# EAGLE design Nyan (EAGLE 6.6.0)
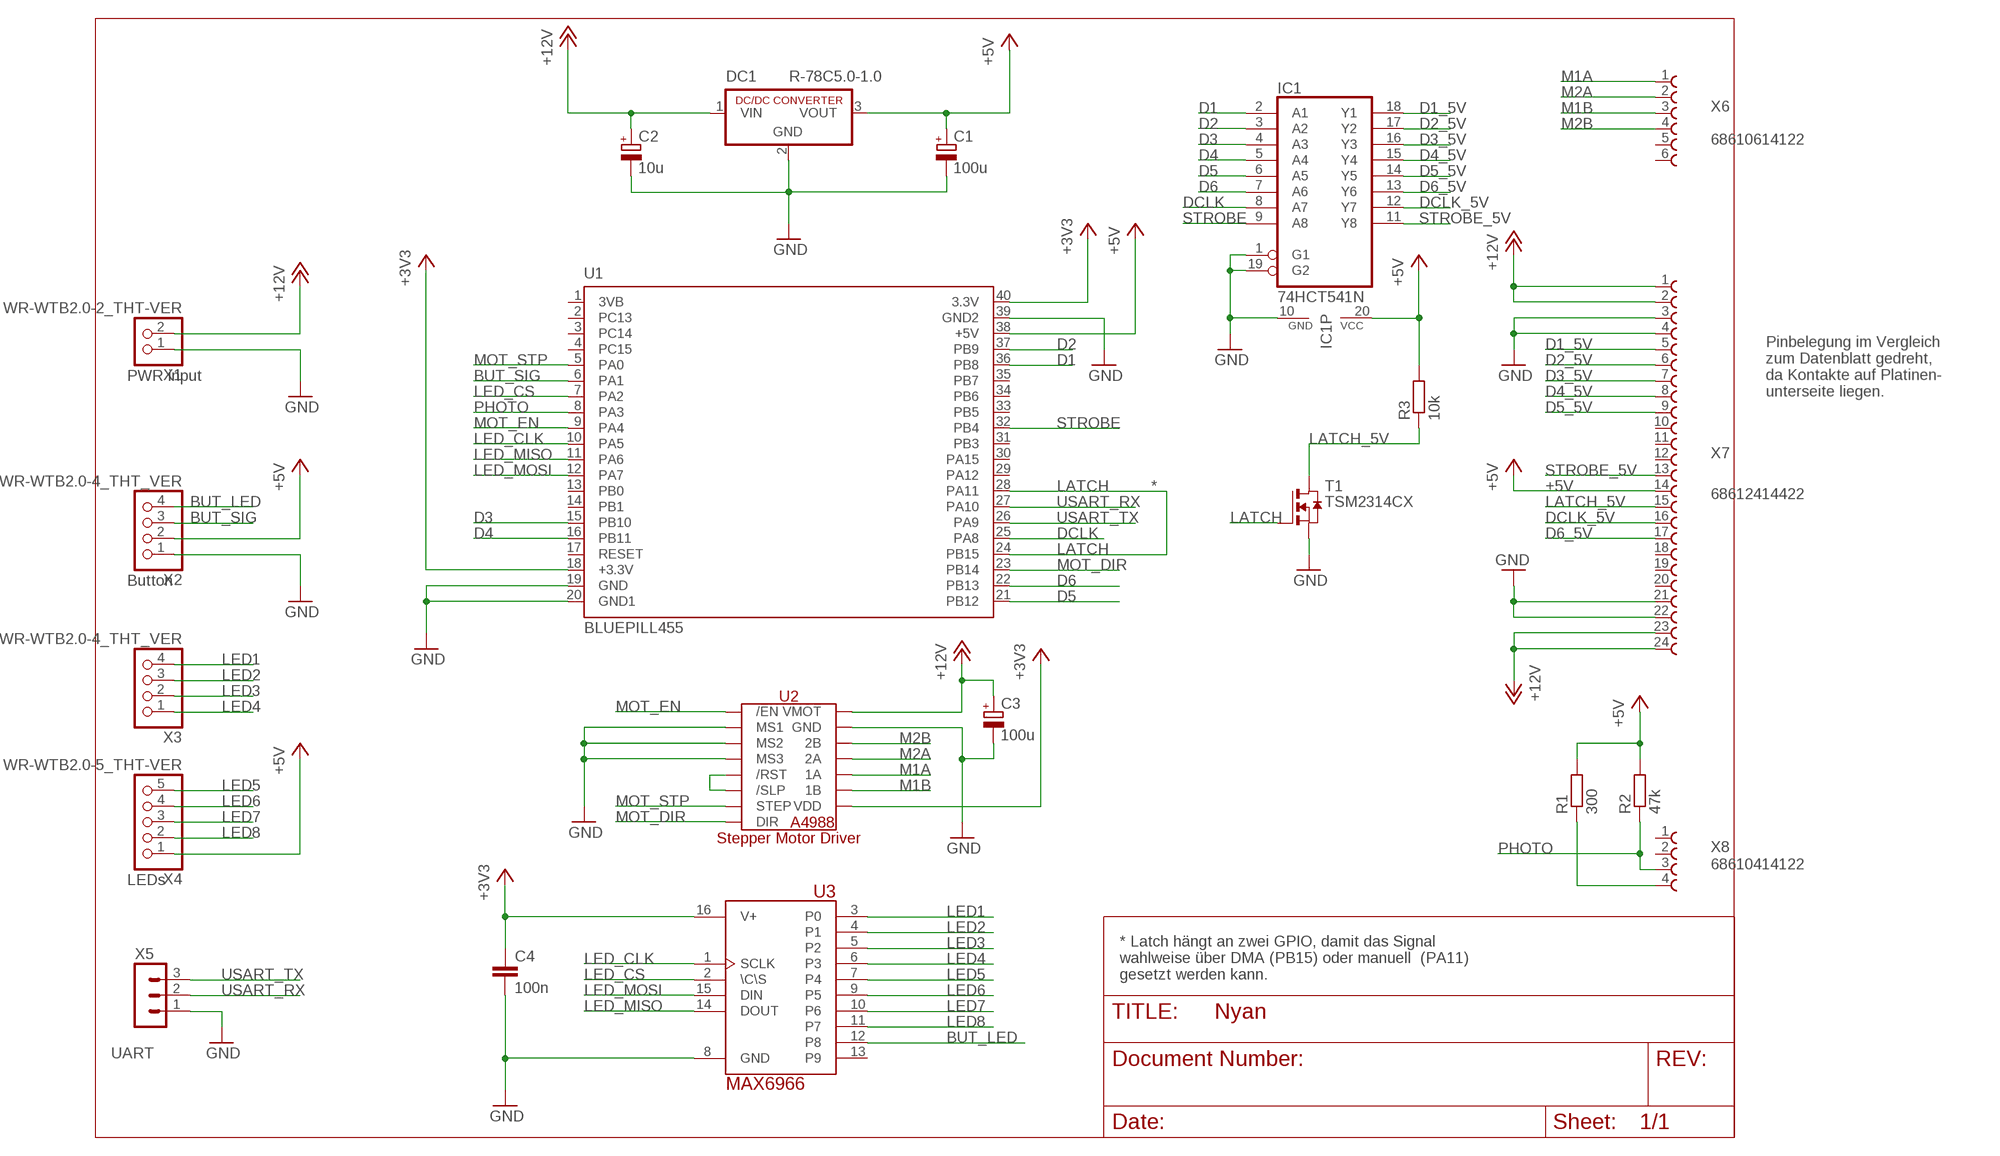
[diagram p0: schematic, sheet 1]

## Parts
C1  100u  CPOL-EUE2.5-6  [E2,5-6]
C2  10u  CPOL-EUE2.5-6  [E2,5-6]
C3  100u  CPOL-EUE2.5-6  [E2,5-6]
C4  100n  C-EU075-032X103  [C075-032X103]
DC1  R-78C5.0-1.0  [SIP3]
IC1  74HCT541N  [DIL20]
R1  300  R-EU_0204/7  [0204/7]
R2  47k  R-EU_0204/7  [0204/7]
R3  10k  R-EU_R0603  [R0603]
T1  TSM2314CX  [SOT-23]
U1  BLUEPILL455  [DIL40]
U2  A4988_STEP  [A4988_STEP]
U3  MAX6966  [QSOP-16]
X1  WR-WTB2.0-2_THT-VER  [WR-WTB2.0-2-THT-VER]
X2  WR-WTB2.0-4_THT_VER  [WR-WTB2.0-4-THT-VER]
X3  WR-WTB2.0-4_THT_VER  [WR-WTB2.0-4-THT-VER]
X4  WR-WTB2.0-5_THT-VER  [WR-WTB2.0-5-THT-VER]
X5  MA03-1ROUND_PAD  [MA03-1_ROUND]
X6  68610614122  [68610614122]
X7  68612414422  [68612414422]
X8  68610414122  [68610414122]

## Nets
+3V3: C4.1 U1.18(+3.3V) U1.40(3.3V) U2.VDD U3.16(V+)
+5V: C1.+ DC1.3(VOUT) IC1.20(VCC) R1.2 R2.2 R3.2 U1.38(+5V) X2.2 X4.1 X7.14
+12V: C2.+ C3.+ DC1.1(VIN) U2.VMOT X1.2 X7.1 X7.2 X7.23 X7.24
BUT_LED: U3.12(P8) X2.4
BUT_SIG: U1.6(PA1) X2.3
D1: IC1.2(A1) U1.36(PB8)
D1_5V: IC1.18(Y1) X7.5
D2: IC1.3(A2) U1.37(PB9)
D2_5V: IC1.17(Y2) X7.6
D3: IC1.4(A3) U1.15(PB10)
D3_5V: IC1.16(Y3) X7.7
D4: IC1.5(A4) U1.16(PB11)
D4_5V: IC1.15(Y4) X7.8
D5: IC1.6(A5) U1.21(PB12)
D5_5V: IC1.14(Y5) X7.9
D6: IC1.7(A6) U1.22(PB13)
D6_5V: IC1.13(Y6) X7.17
DCLK: IC1.8(A7) U1.25(PA8)
DCLK_5V: IC1.12(Y7) X7.16
GND: C1.- C2.- C3.- C4.2 DC1.2(GND) IC1.1(G1) IC1.10(GND) IC1.19(G2) T1.2(S) U1.19(GND) U1.20(GND1) U1.39(GND2) U2.GND U2.GND2(GND) U2.MS1 U2.MS2 U2.MS3 U3.8(GND) X1.1 X2.1 X5.1 X7.3 X7.4 X7.21 X7.22
LATCH: T1.1(G) U1.24(PB15) U1.28(PA11)
LATCH_5V: R3.1 T1.3(D) X7.15
LED1: U3.3(P0) X3.4
LED2: U3.4(P1) X3.3
LED3: U3.5(P2) X3.2
LED4: U3.6(P3) X3.1
LED5: U3.7(P4) X4.5
LED6: U3.9(P5) X4.4
LED7: U3.10(P6) X4.3
LED8: U3.11(P7) X4.2
LED_CLK: U1.10(PA5) U3.1(SCLK)
LED_CS: U1.7(PA2) U3.2(\C\S)
LED_MISO: U1.11(PA6) U3.14(DOUT)
LED_MOSI: U1.12(PA7) U3.15(DIN)
M1A: U2.1A X6.1
M1B: U2.1B X6.3
M2A: U2.2A X6.2
M2B: U2.2B X6.4
MOT_DIR: U1.23(PB14) U2.DIR
MOT_EN: U1.9(PA4) U2./EN
MOT_STP: U1.5(PA0) U2.STEP
N$1: R1.1 X8.4
N$2: U2./RST U2./SLP
PHOTO: R2.1 U1.8(PA3) X8.3
STROBE: IC1.9(A8) U1.32(PB4)
STROBE_5V: IC1.11(Y8) X7.13
USART_RX: U1.27(PA10) X5.2
USART_TX: U1.26(PA9) X5.3
Unconnected: U1.1(3VB) U1.2(PC13) U1.3(PC14) U1.4(PC15) U1.13(PB0) U1.14(PB1) U1.17(RESET) U1.29(PA12) U1.30(PA15) U1.33(PB5) U1.34(PB6) U1.35(PB7) U3.13(P9) X6.5 X6.6 X7.10 X7.11 X7.12 X7.18 X7.19 X7.20 X8.1 X8.2

## Notes on the sheet
- PWR input
- Pinbelegung im Vergleich
  zum Datenblatt gedreht,
  da Kontakte auf Platinen-
  unterseite liegen.
- *
- Button
- LEDs
- * Latch hängt an zwei GPIO, damit das Signal
  wahlweise über DMA (PB15) oder manuell  (PA11)
  gesetzt werden kann.
- UART

## Power pins joined to a net without a drawn wire
PB3: U1.31(PB3)

## Library data of the parts
C1-C3 = rcl:CPOL-EU: POLARIZED CAPACITOR, European symbol
C4 = rcl:C-EU: CAPACITOR, European symbol
DC1 = dc-dc-converter:R-78C*-1.0: INNOLINE DC/DC-Converter 1.0 AMP SIP3 Single Output Source: Data sheet <http://www.mikrocontroller.net/attachment/150645/157764-da-01-en-DC_DC_WANDLER_R_78C5_0_1_0.pdf>
IC1 = 74xx-eu:74*541: Octal BUFFER and LINE DRIVER, 3-state
R1-R3 = rcl:R-EU_: RESISTOR, European symbol
T1 = TURAG_Mosfet_N-Kanal:TSM2314CX; FARNELL: 1864589
U1 = STM32BluePill:BLUEPILL: BluePill STM32F108T6 Dev Board Source: http://www.stm32duino.com; 0: x; MF: BluePill; MPN: BluePill; X: 0
U2 = robotics:A4988_STEP
U3 = meineLibrary:MAX6966
X1 = TURAG_Steckverbinder:WR-WTB2.0-2; WUERTH: 62000211622:620002113322
X2 X3 = TURAG_Steckverbinder:WR-WTB2.0-4; WUERTH: 62000411622:620004113322
X4 = TURAG_Steckverbinder:WR-WTB2.0-5; WUERTH: 62000511622:620005113322
X5 = con-lstb:MA03-1: PIN HEADER; REICHELT: MPE 087-1-003
X6 = Wuerth_Elektronik_eiCan_03_ZIF_Connectors_Flat_Flexible_Cable:68610614122: WR-FPC 1.00mm SMT ZIF Horizontal Top Contact, 6 Pins
X7 = Wuerth_Elektronik_eiCan_03_ZIF_Connectors_Flat_Flexible_Cable:68612414422: WR-FPC 1.00mm SMT ZIF Horizontal Bottom Contact, 24 Pins
X8 = Wuerth_Elektronik_eiCan_03_ZIF_Connectors_Flat_Flexible_Cable:68610414122: WR-FPC 1.00mm SMT ZIF Horizontal Top Contact, 4 Pins

## Board
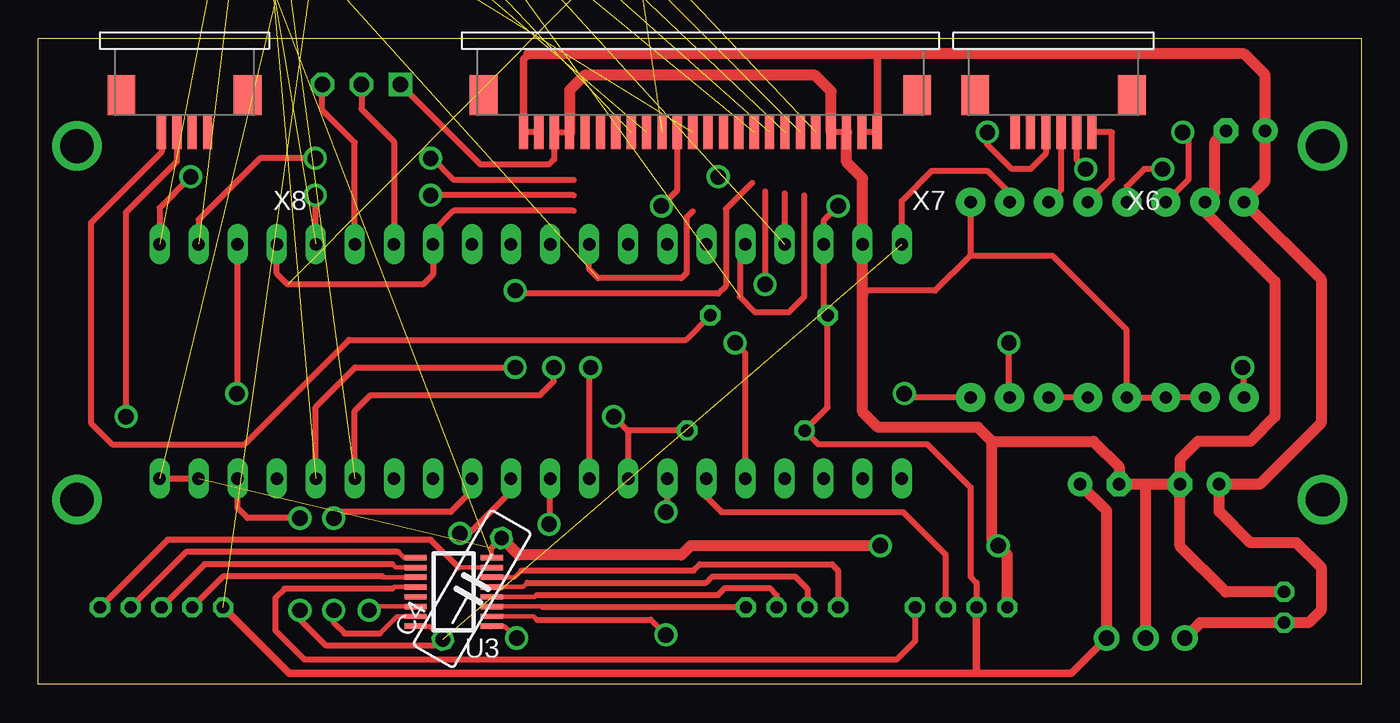
[diagram p1: board, top side]
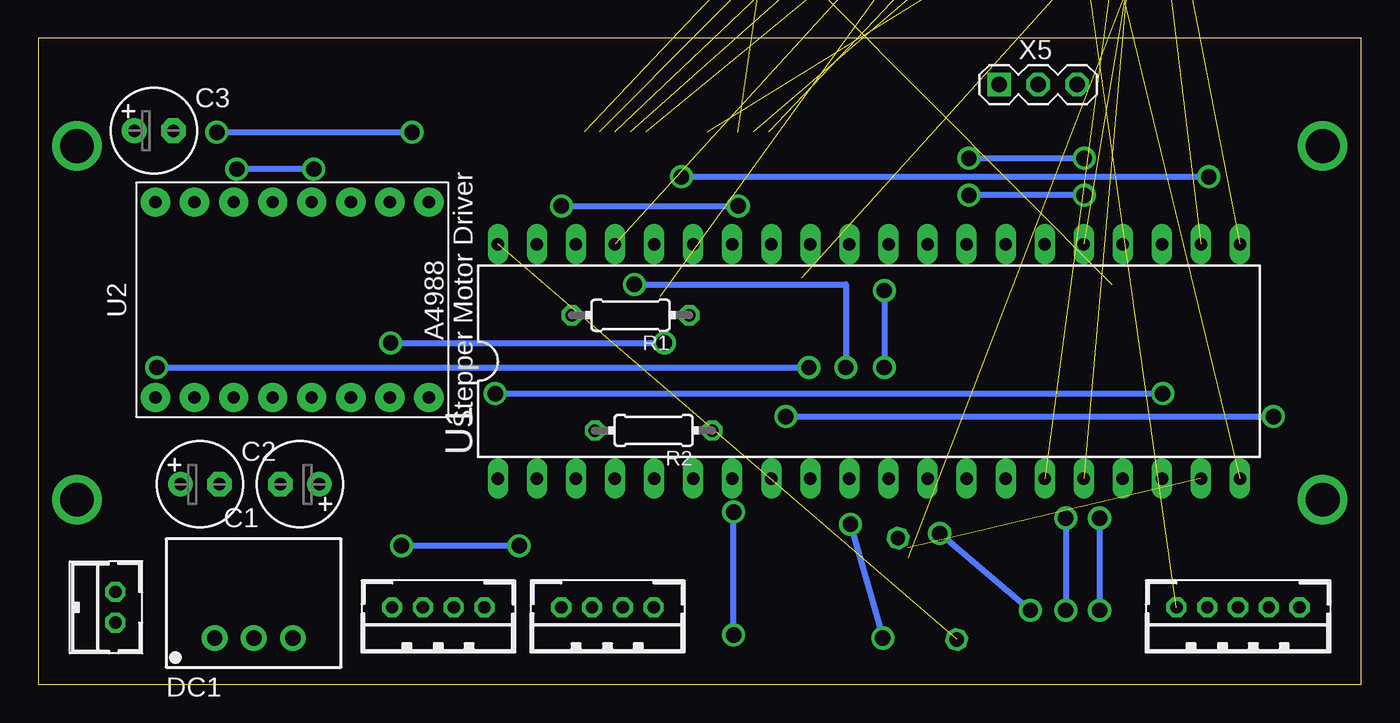
[diagram p2: board, bottom side, seen from below]

Size 86 x 42 mm. Coordinates in mm from the lower left corner, seen from the top.
Outline: 86,0 0,0 0,42 86,42 86,0
Copper layers (1*16): Top 0.035mm / dielectric 1.5mm / Bottom 0.035mm
Design rules "default": minimum track width 10mil, minimum drill 24mil, track to track 8mil, track to pad 8mil, pad to pad 8mil, via to via 8mil, smd to smd 8mil, copper to edge 40mil, drill to drill 8mil, minimum pad ring 10mil, minimum via ring 8mil, stop-mask expansion 4mil, vias tented up to drill 0mil, thermal gap 10mil

### Footprints (pad centres in the part's own frame; a part is rotated, then mirrored left to right if it is on the bottom)
E2,5-6 = drill 0.813 pad 1.6: + -1.27,0 | drill 0.813 pad 1.6 octagon: - 1.27,0
C075-032X103 = drill 0.914 octagon: 1 -3.81,0; 2 3.81,0
SIP3 = drill 1 pad 1.676: 1 -2.54,0; 2 0,0; 3 2.54,0
DIL20 = drill 0.813 long: 1 -11.43,-3.81; 2 -8.89,-3.81; 3 -6.35,-3.81; 4 -3.81,-3.81; 5 -1.27,-3.81; 6 1.27,-3.81; 7 3.81,-3.81; 8 6.35,-3.81; 9 8.89,-3.81; 10 11.43,-3.81; 11 11.43,3.81; 12 8.89,3.81; 13 6.35,3.81; 14 3.81,3.81; 15 1.27,3.81; 16 -1.27,3.81; 17 -3.81,3.81; 18 -6.35,3.81; 19 -8.89,3.81; 20 -11.43,3.81
0204/7 = drill 0.813 octagon: 1 -3.81,0; 2 3.81,0
R0603 = smd 1 x 1.1: 1 -0.85,0; 2 0.85,0
SOT-23 = smd 1 x 1.4: 1 -0.95,-1.1; 2 0.95,-1.1; 3 0,1.1
DIL40 = drill 0.813 long: 1 -24.13,-7.62; 2 -21.59,-7.62; 3 -19.05,-7.62; 4 -16.51,-7.62; 5 -13.97,-7.62; 6 -11.43,-7.62; 7 -8.89,-7.62; 8 -6.35,-7.62; 9 -3.81,-7.62; 10 -1.27,-7.62; 11 1.27,-7.62; 12 3.81,-7.62; 13 6.35,-7.62; 14 8.89,-7.62; 15 11.43,-7.62; 16 13.97,-7.62; 17 16.51,-7.62; 18 19.05,-7.62; 19 21.59,-7.62; 20 24.13,-7.62; 21 24.13,7.62; 22 21.59,7.62; 23 19.05,7.62; 24 16.51,7.62; 25 13.97,7.62; 26 11.43,7.62; 27 8.89,7.62; 28 6.35,7.62; 29 3.81,7.62; 30 1.27,7.62; 31 -1.27,7.62; 32 -3.81,7.62; 33 -6.35,7.62; 34 -8.89,7.62; 35 -11.43,7.62; 36 -13.97,7.62; 37 -16.51,7.62; 38 -19.05,7.62; 39 -21.59,7.62; 40 -24.13,7.62
A4988_STEP = drill 0.8 pad 1.905: 1A 6.35,-1.27; 1B 6.35,-3.81; 2A 6.35,1.27; 2B 6.35,3.81; /EN -6.35,8.89; /RST -6.35,-1.27; /SLP -6.35,-3.81; DIR -6.35,-8.89; GND 6.35,6.35; GND2 6.35,-8.89; MS1 -6.35,6.35; MS2 -6.35,3.81; MS3 -6.35,1.27; STEP -6.35,-6.35; VDD 6.35,-6.35; VMOT 6.35,8.89
QSOP-16 = smd 0.35 x 1.45: 1 -2.223,-2.475; 2 -1.587,-2.475; 3 -0.953,-2.475; 4 -0.318,-2.475; 5 0.318,-2.475; 6 0.953,-2.475; 7 1.587,-2.475; 8 2.223,-2.475; 9 2.223,2.475; 10 1.587,2.475; 11 0.953,2.475; 12 0.318,2.475; 13 -0.318,2.475; 14 -0.953,2.475; 15 -1.587,2.475; 16 -2.223,2.475
WR-WTB2.0-2-THT-VER = drill 0.8 octagon: 1 1,0; 2 -1,0
WR-WTB2.0-4-THT-VER = drill 0.8 octagon: 1 3,0; 2 1,0; 3 -1,0; 4 -3,0
WR-WTB2.0-5-THT-VER = drill 0.8 octagon: 1 4,0; 2 2,0; 3 0,0; 4 -2,0; 5 -4,0
MA03-1_ROUND = drill 1.016 square: 1 -2.54,0 | drill 1.016 octagon: 2 0,0; 3 2.54,0
68610614122 = smd 0.6 x 2.2: 1 -2.5,1.1; 2 -1.5,1.1; 3 -0.5,1.1; 4 0.5,1.1; 5 1.5,1.1; 6 2.5,1.1 | smd 1.8 x 2.6: Z1 -5.1,-1.3; Z2 5.1,-1.3
68612414422 = smd 0.6 x 2.2: 1 -11.54,1.1; 2 -10.54,1.1; 3 -9.54,1.1; 4 -8.54,1.1; 5 -7.54,1.1; 6 -6.54,1.1; 7 -5.54,1.1; 8 -4.54,1.1; 9 -3.54,1.1; 10 -2.54,1.1; 11 -1.54,1.1; 12 -0.54,1.1; 13 0.46,1.1; 14 1.46,1.1; 15 2.46,1.1; 16 3.46,1.1; 17 4.46,1.1; 18 5.46,1.1; 19 6.46,1.1; 20 7.46,1.1; 21 8.46,1.1; 22 9.46,1.1; 23 10.46,1.1; 24 11.46,1.1 | smd 1.8 x 2.6: Z1 -14.14,-1.3; Z2 14.06,-1.3
68610414122 = smd 0.6 x 2.2: 1 -1.5,1.1; 2 -0.5,1.1; 3 0.5,1.1; 4 1.5,1.1 | smd 1.8 x 2.6: Z1 -4.1,-1.3; Z2 4.1,-1.3

### Placement (x,y rotation side)
C1  69,13 180 bottom
C2  75.5,13 0 bottom
C3  78.5,36 0 bottom
C4  28.2,6.2 60 top
DC1  72,3 0 bottom
IC1  17.6,60.4 270 top  (outside the outline)
R1  47.5,24 180 bottom
R2  46,16.5 180 bottom
R3  37.8,55.8 180 top  (outside the outline)
T1  39.4,51.4 90 top  (outside the outline)
U1  32,21 0 bottom
U2  69.5,25 90 bottom
U3  27,6 90 top
X1  81,5 90 bottom
X2  60,5 180 bottom
X3  49,5 180 bottom
X4  8,5 180 bottom
X5  21,39 0 bottom
X6  66,37 180 top
X7  43,37 180 top
X8  9.5,37 180 top

### Tracks (layer width: path | path; a pad name or v marks a point on that pad's centre or on a via)
+3V3  (via drill 1)  (1 unrouted)
  Top 0.3: C4.1 25.42,3.78 U3.16
  Top 0.4: U1.40 56.13,31.43 58.1,33.4 61.7,33.4 63.15,31.95 U2.VDD | C4.1 25.89,2.5 18.7,2.5 17,4.2 v17,4.8 | v17,10.8 13.6,10.8 12.95,11.45 U1.18
  Bottom 0.4: v17,4.8 v17,10.8
+5V  (via drill 1)  (2 unrouted)
  Top 0.4: X2.2 61,6.6 60.6,7 60.6,12.8 57.8,15.6 50.71,15.6 R2.2 51.31,18 R1.2 51.05,24.26 U1.38 51.05,30.15 v52,31.1 | v40.5,31.1 41.54,32.14 X7.14
  Top 0.5: DC1.3 67.16,0.7 61,0.7 | 61,0.7 16.3,0.7 X4.1 | X2.2 61,0.7
  Top 0.7: DC1.3 69.46,11.27 C1.+
  Bottom 0.4: v52,31.1 v40.5,31.1
+12V
  Top 0.4: X7.1 X7.2 | X7.23 X7.24
  Top 0.5: X7.24 31.54,40.64 31.9,41 | X7.1 54.54,40.94 54.6,41
  Top 0.7: 31.9,41 54.6,41 78.4,41 79.77,39.63 C3.+ 79.77,32.73 U2.VMOT 83.4,26.34 83.4,17 79.4,13 C2.+ 76.77,11.23 78.8,9.2 81.8,9.2 83.4,7.6 83.4,4.8 82.6,4 X1.2 75.54,4 DC1.1
BUT_LED
  Top 0.3: U3.12 23.12,6.32 23,6.2
  Top 0.4: 23,6.2 16,6.2 15.4,5.6 15.4,3.5 17.3,1.6 55.8,1.6 57,2.8 X2.4
BUT_SIG
  Top 0.4: U1.6 43.43,12.17 44.4,11.2 56.2,11.2 59,8.4 X2.3
D1  (1 unrouted)
  Top 0.4: U1.36 45.6,28.25 45.6,25.2 46.6,24.2 48.8,24.2 49.8,25.2 49.8,31.8
D1_5V  (1 unrouted)
D2  (1 unrouted)
  Top 0.4: 48.51,31.91 U1.37
D2_5V  (1 unrouted)
D3  (via drill 1)  (1 unrouted)
  Top 0.4: 47.25,32.05 v47.25,26 | U1.15 20.57,17.77 21.6,18.8 32.6,18.8 33.5,19.7 v33.5,20.6
  Bottom 0.4: v47.25,26 33.5,26 v33.5,20.6
D3_5V  (1 unrouted)
D4  (via drill 1)  (1 unrouted)
  Top 0.4: U1.16 18.03,18.03 20.6,20.6 v31,20.6 | v31,25.6 31.2,25.4 44.2,25.4 44.7,25.9 44.7,30.9 46.4,32.6
  Bottom 0.4: v31,25.6 v31,20.6
D4_5V  (1 unrouted)
D5  (via drill 1)  (1 unrouted)
  Top 0.4: v9.9,33 7.87,30.97 U1.21
  Bottom 0.4: v44.2,33 v9.9,33
D5_5V  (1 unrouted)
D6  (via drill 1)  (1 unrouted)
  Top 0.4: 34.8,32.8 27,32.8 25.6,34.2 v25.5,34.2 | v18,34.2 14.4,34.2 10.41,30.21 U1.22
  Bottom 0.4: v25.5,34.2 v18,34.2
D6_5V  (1 unrouted)
DCLK  (via drill 1)  (1 unrouted)
  Top 0.4: v18,31.8 18,28.65 U1.25 | 34.8,31.8 v25.5,31.8
  Bottom 0.4: v18,31.8 v25.5,31.8
DCLK_5V  (1 unrouted)
GND  (via drill 1)  (5 unrouted)
  Top 0.3: 29.48,8.87 U3.8
  Top 0.4: X7.3 X7.4 | X7.21 X7.22 33.54,34.14 33.2,33.8 28.74,33.8 X5.1 | U2.GND2 60.61,27.91 60.55,27.85 | 60.55,27.85 58.3,25.6 53.89,25.6 53.59,25.3 | v62.4,9 62.21,9 62.31,9.1 | C4.2 29.48,8.87 | U1.20 U1.19 | U2.MS1 U2.MS2 U2.MS3 70.77,23.03 65.95,27.85 60.55,27.85
  Top 0.7: C2.- 72,13 | 72,13 C1.- 70.27,14.13 68.6,15.8 62,15.8 | C2.- 74.23,8.97 77.2,6 X1.1 | DC1.2 72,13 | C3.- 76.5,35.27 76.5,32 U2.GND 75.85,30.75 80.4,26.2 80.4,17.4 78.8,15.8 75.4,15.8 74.23,14.63 C2.- | X7.3 52.54,33.96 53.59,32.91 U1.39 53.59,25.3 53.59,17.71 54.6,16.7 61.1,16.7 62,15.8 | X7.4 51.54,38.56 50.5,39.6 35.5,39.6 34.54,38.64 X7.21 | X2.1 63,8.41 62.31,9.1 62,9.41 62,15.8 | C4.2 31.2,8.4 41.8,8.4 42.4,9 v54.74,9
  Bottom 0.4: v54.74,9 v62.4,9
LATCH  (1 unrouted)
  Top 0.4: 34.8,30.8 27,30.8 25.65,29.45 U1.28 25.65,26.65 25,26 16.2,26 15.49,26.71 U1.24
LATCH_5V  (2 unrouted)
LED1
  Top 0.3: 32.8,5 32.75,5.05 U3.3
  Top 0.4: X3.4 45.95,5.05 45.91,5 32.8,5
LED2
  Top 0.3: U3.4 32.28,5.68 32.4,5.8
  Top 0.4: X3.3 48,5.8 47.55,6.25 44.65,6.25 44.2,5.8 32.4,5.8
LED3
  Top 0.3: U3.5 31.52,6.32 31.8,6.6
  Top 0.4: X3.2 50,6.2 49.2,7 43.8,7 43.4,6.6 31.8,6.6
LED4
  Top 0.3: U3.6 30.95,6.95 31.4,7.4
  Top 0.4: X3.1 52,7.4 51.6,7.8 43,7.8 42.6,7.4 31.4,7.4
LED5
  Top 0.3: 27.31,7.59 U3.7
  Top 0.4: 27.31,7.59 25.5,9.4 8.4,9.4 X4.5
LED6
  Top 0.3: U3.9 23.78,8.22 23.4,8.6
  Top 0.4: 23.4,8.6 9.6,8.6 X4.4
LED7
  Top 0.3: U3.10 23.21,7.59 23,7.8
  Top 0.4: 23,7.8 10.8,7.8 X4.3
LED8
  Top 0.3: U3.11 22.45,6.95 22.4,7
  Top 0.4: 22.4,7 12,7 X4.2
LED_CLK  (via drill 1)
  Top 0.3: 29.4,3.7 U3.1 30.32,3.78 v31.1,3
  Top 0.4: U1.10 33.27,10.47 v33.2,10.4
  Bottom 0.4: v33.2,10.4 v31.1,3
LED_CS  (via drill 1)
  Top 0.3: U3.2 32.19,4.41 32.4,4.2
  Top 0.4: v40.8,11.2 40.89,11.29 U1.7 | 32.4,4.2 39.8,4.2 v40.8,3.2
  Bottom 0.4: v40.8,3.2 v40.8,11.2
LED_MISO  (via drill 1)
  Top 0.3: v21.5,4.8 21.75,5.05 U3.14
  Top 0.4: U1.11 30.73,12.53 28,9.8 v27.4,9.8
  Bottom 0.4: v27.4,9.8 v21.5,4.8
LED_MOSI  (via drill 1)
  Top 0.3: U3.15 23.31,4.41 22.2,3.3
  Top 0.4: U1.12 28.19,12.59 26.8,11.2 19.6,11.2 v19.2,10.8 | v19.2,4.8 19.2,4 19.9,3.3 22.2,3.3
  Bottom 0.4: v19.2,10.8 v19.2,4.8
M1A
  Top 0.4: U2.1A 68.25,31.35 69.8,32.9 69.8,35.9 X6.1
M1B
  Top 0.4: U2.1B 66.5,32.16 X6.3
M2A  (via drill 1)
  Top 0.4: U2.2A 70.77,32.37 71.9,33.5 v73.1,33.5 | X6.2 67.5,34.1 v68.1,33.5
  Bottom 0.4: v68.1,33.5 v73.1,33.5
M2B  (via drill 1)
  Top 0.4: U2.2B 74.8,32.84 74.8,35.5 v74.4,35.9 | X6.4 65.5,34.5 64.5,33.5 63.3,33.5 61.7,35.1 v61.7,35.9
  Bottom 0.4: v74.4,35.9 v61.7,35.9
MOT_DIR  (via drill 1)
  Top 0.4: U2.DIR 56.55,18.65 v56.3,18.9 | v12.9,18.9 12.95,18.95 U1.23
  Bottom 0.4: v56.3,18.9 v12.9,18.9
MOT_EN  (via drill 1)
  Top 0.4: U2./EN 78.39,20.51 v78.3,20.6 | v35.9,20.6 35.81,20.51 U1.9
  Bottom 0.4: v78.3,20.6 v35.9,20.6
MOT_STP  (via drill 1)
  Top 0.4: U2.STEP 63.1,18.7 v63.1,22.2 | U1.5 45.97,21.53 v45.3,22.2
  Bottom 0.4: v63.1,22.2 v45.3,22.2
N$1
  Top 0.4: X8.4 8,34.6 3.4,30 3.4,17 4.8,15.6 13.4,15.6 20.2,22.4 42.09,22.4 R1.1
N$2
  Top 0.4: U2./RST U2./SLP
N$3  (via drill 2.2)
  other vias: 83.5,12
N$4  (via drill 2.2)
  other vias: 83.5,35
N$5  (via drill 2.2)
  other vias: 2.5,12
N$6  (via drill 2.2)
  other vias: 2.5,35
PHOTO  (via drill 1)
  Top 0.4: R2.1 38.3,16.5 | U1.8 38.35,16.45 38.3,16.5 | v37.4,17.4 38.3,16.5 | X8.3 9,34 5.7,30.7 v5.7,17.4
  Bottom 0.4: v37.4,17.4 v5.7,17.4
STROBE  (1 unrouted)
  Top 0.4: 42.54,30.74 42.15,30.35 42.15,26.75 41.8,26.4 36.4,26.4 35.81,26.99 U1.32
STROBE_5V  (1 unrouted)
USART_RX
  Top 0.4: X5.2 21,37.4 23.11,35.29 U1.27
USART_TX
  Top 0.4: U1.26 20.57,35.23 18.46,37.34 X5.3